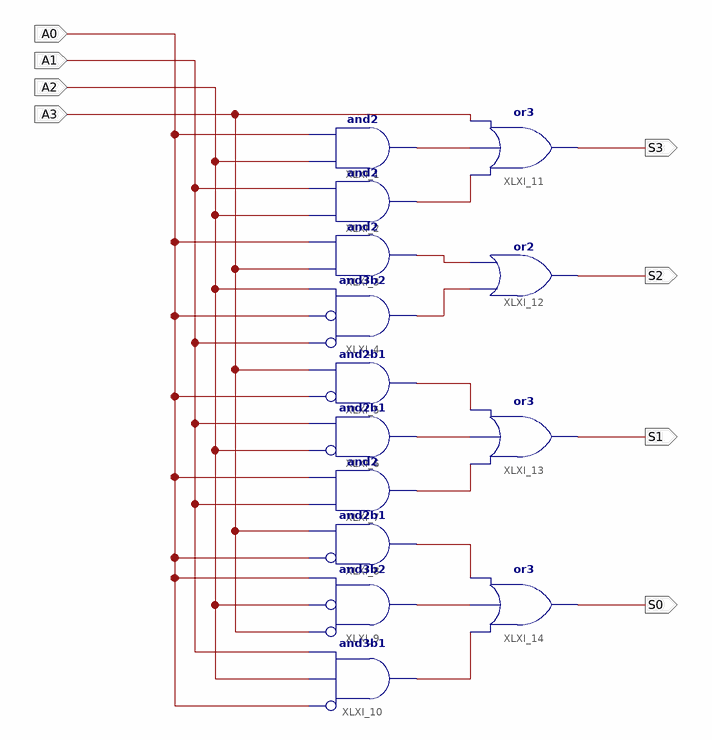
[diagram p0: schematic sheet 1]
// Xilinx ISE schematic C3.sch (spartan3e) as structural Verilog: 14 symbols, 8 ports
module C3 (
  input  A0,
  input  A1,
  input  A2,
  input  A3,
  output S3,
  output S2,
  output S1,
  output S0
);

  wire XLXN_24, XLXN_25, XLXN_26, XLXN_27, XLXN_28, XLXN_29, XLXN_30, XLXN_31, XLXN_32, XLXN_33;

  and XLXI_1 (XLXN_24, A2, A0);
  and XLXI_2 (XLXN_25, A2, A1);
  and XLXI_3 (XLXN_26, A3, A0);
  and XLXI_4 (XLXN_27, ~A1, ~A0, A2);  // and3b2
  and XLXI_5 (XLXN_28, ~A0, A3);  // and2b1
  and XLXI_6 (XLXN_29, ~A2, A1);  // and2b1
  and XLXI_7 (XLXN_30, A1, A0);
  and XLXI_8 (XLXN_31, ~A0, A3);  // and2b1
  and XLXI_9 (XLXN_32, ~A3, ~A2, A0);  // and3b2
  and XLXI_10 (XLXN_33, ~A0, A2, A1);  // and3b1
  or XLXI_11 (S3, XLXN_25, XLXN_24, A3);
  or XLXI_12 (S2, XLXN_27, XLXN_26);
  or XLXI_13 (S1, XLXN_30, XLXN_29, XLXN_28);
  or XLXI_14 (S0, XLXN_33, XLXN_32, XLXN_31);
endmodule
